# EAGLE design UltiMem64_v2 (EAGLE 7.7.0)

## Sheet 1 of 2
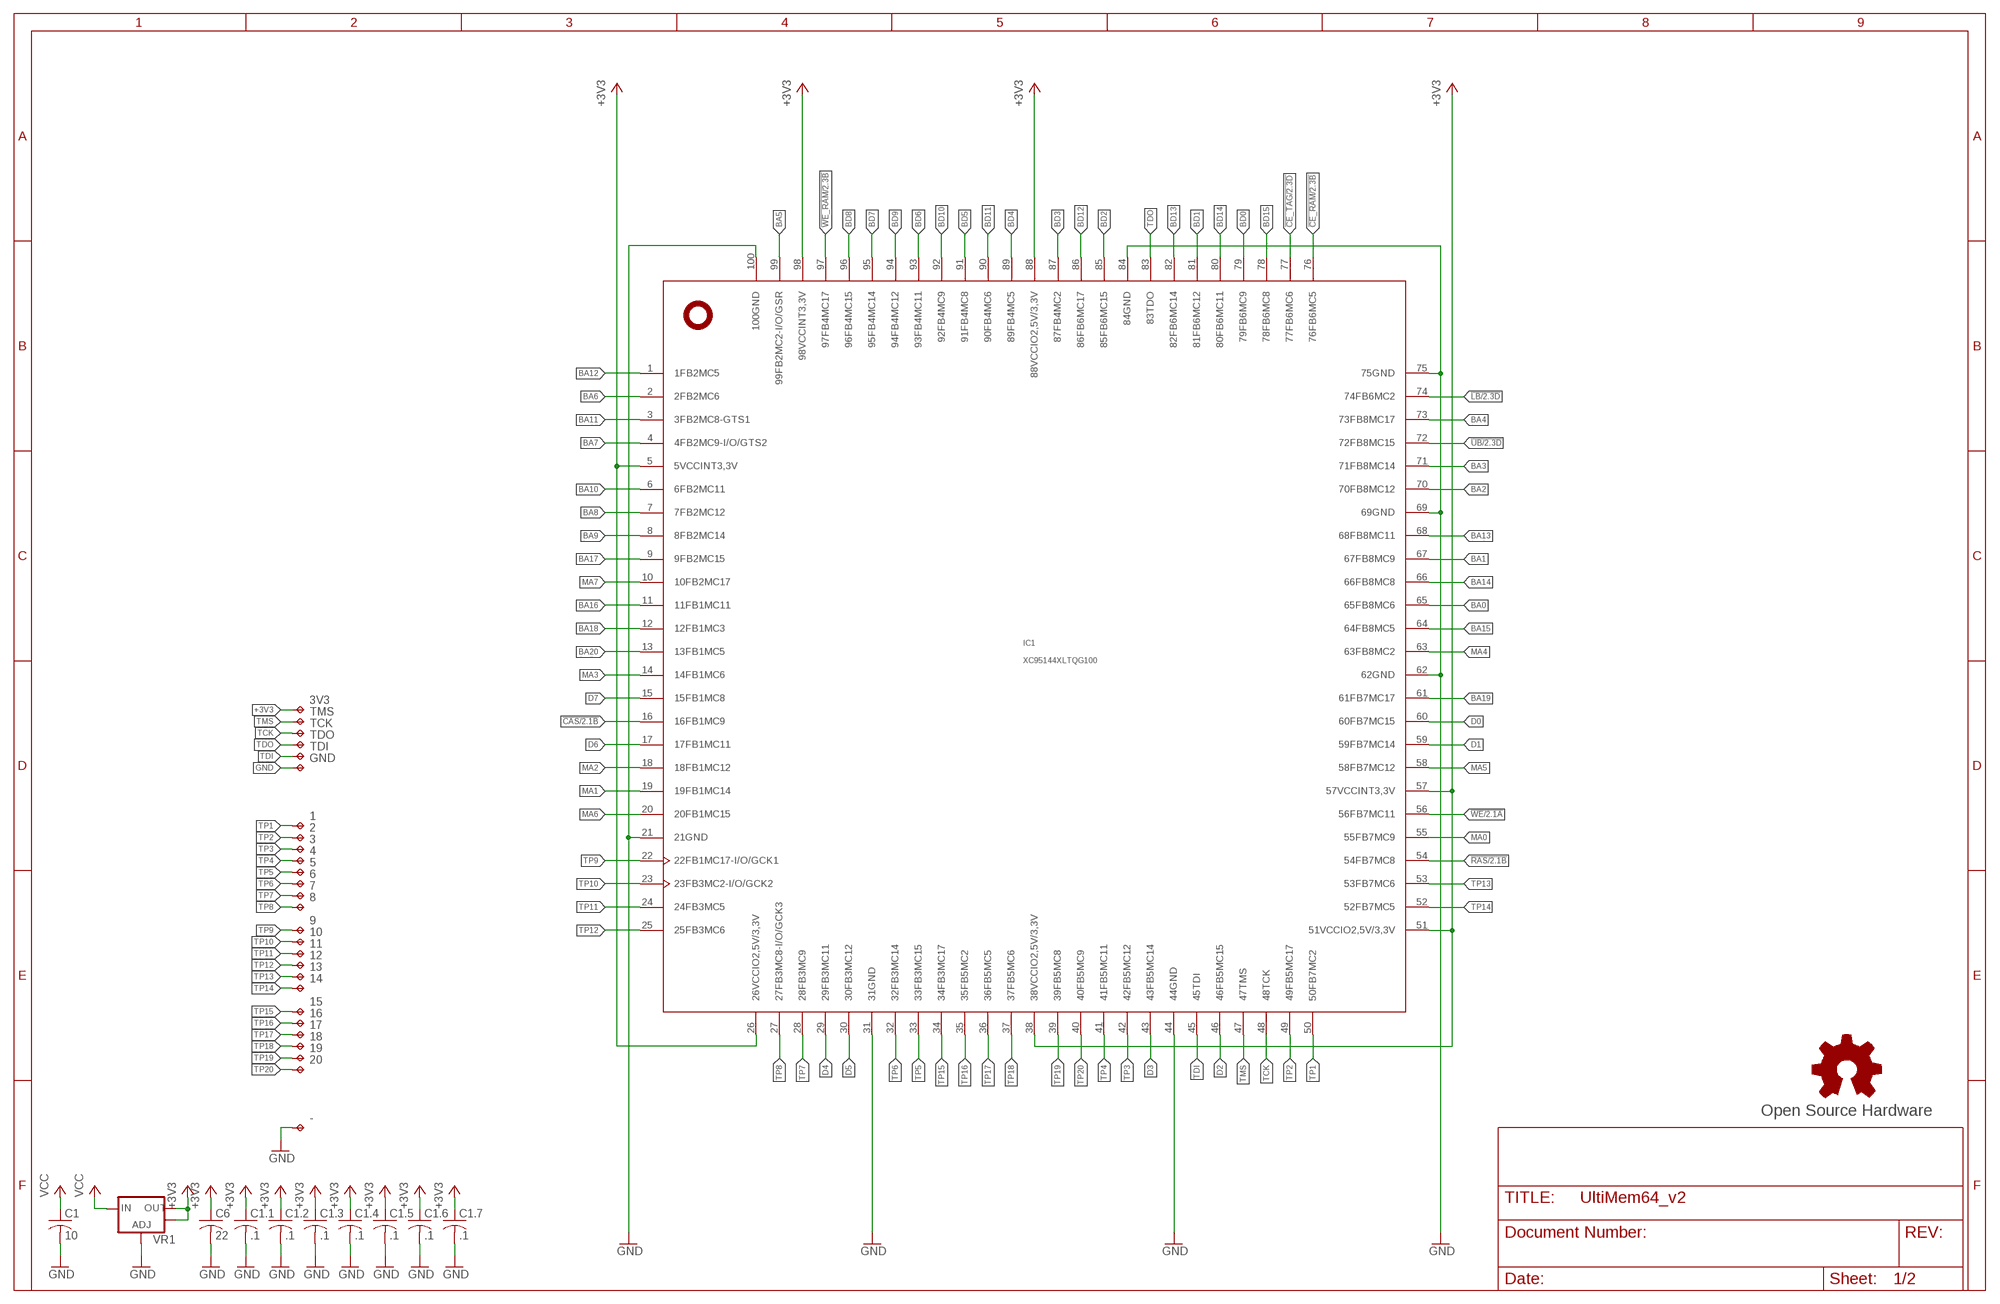
[diagram p0: schematic, sheet 1]

### Parts
1  TPPAD1-13  [P1-13]
2  TPPAD1-13  [P1-13]
3  TPPAD1-13  [P1-13]
3V3  TPTP09R  [TP09R]
4  TPPAD1-13  [P1-13]
5  TPPAD1-13  [P1-13]
6  TPPAD1-13  [P1-13]
7  TPPAD1-13  [P1-13]
8  TPPAD1-13  [P1-13]
9  TPPAD1-13  [P1-13]
10  TPPAD1-13  [P1-13]
11  TPPAD1-13  [P1-13]
12  TPPAD1-13  [P1-13]
13  TPPAD1-13  [P1-13]
14  TPPAD1-13  [P1-13]
15  TPTP08R  [TP08R]
16  TPTP08R  [TP08R]
17  TPTP08R  [TP08R]
18  TPTP08R  [TP08R]
19  TPTP08R  [TP08R]
20  TPTP08R  [TP08R]
-  TPPAD1-13  [P1-13]
C1  10  C-USC0805  [C0805]
C1.1  .1  C-USC0402  [C0402]
C1.2  .1  C-USC0402  [C0402]
C1.3  .1  C-USC0402  [C0402]
C1.4  .1  C-USC0402  [C0402]
C1.5  .1  C-USC0402  [C0402]
C1.6  .1  C-USC0402  [C0402]
C1.7  .1  C-USC0402  [C0402]
C6  22  C-USC0805  [C0805]
GND  TPTP10R  [TP10R]
GOLD_ORB_SM1  Open Source Hardware  OSHWLOGOLOGO5MM  [OSHW_5MM]
IC1  XC95144XLTQG100  [TQFP100]
TCK  TPTP09R  [TP09R]
TDI  TPTP09R  [TP09R]
TDO  TPTP09R  [TP09R]
TMS  TPTP09R  [TP09R]
VR1  V_REG_LM1117SOT223  [SOT223]

### Nets
!CAS: IC1.16(16FB1MC9) ; also sheet 2
!CE_RAM: IC1.76(76FB6MC5) ; also sheet 2
!CE_TAG: IC1.77(77FB6MC6) ; also sheet 2
!LB: IC1.74(74FB6MC2) ; also sheet 2
!RAS: IC1.54(54FB7MC8) ; also sheet 2
!UB: IC1.72(72FB8MC15) ; also sheet 2
!WE: IC1.56(56FB7MC11) ; also sheet 2
!WE_RAM: IC1.97(97FB4MC17) ; also sheet 2
+3V3: 3V3.TP C1.1.1 C1.2.1 C1.3.1 C1.4.1 C1.5.1 C1.6.1 C1.7.1 C6.1 IC1.5(5VCCINT3,3V) IC1.26(26VCCIO2,5V/3,3V) IC1.38(38VCCIO2,5V/3,3V) IC1.51(51VCCIO2,5V/3,3V) IC1.57(57VCCINT3,3V) IC1.88(88VCCIO2,5V/3,3V) IC1.98(98VCCINT3,3V) VR1.2(OUT) VR1.4(OUT) ; also sheet 2
BA0: IC1.65(65FB8MC6) ; also sheet 2
BA1: IC1.67(67FB8MC9) ; also sheet 2
BA2: IC1.70(70FB8MC12) ; also sheet 2
BA3: IC1.71(71FB8MC14) ; also sheet 2
BA4: IC1.73(73FB8MC17) ; also sheet 2
BA5: IC1.99(99FB2MC2-I/O/GSR) ; also sheet 2
BA6: IC1.2(2FB2MC6) ; also sheet 2
BA7: IC1.4(4FB2MC9-I/O/GTS2) ; also sheet 2
BA8: IC1.7(7FB2MC12) ; also sheet 2
BA9: IC1.8(8FB2MC14) ; also sheet 2
BA10: IC1.6(6FB2MC11) ; also sheet 2
BA11: IC1.3(3FB2MC8-GTS1) ; also sheet 2
BA12: IC1.1(1FB2MC5) ; also sheet 2
BA13: IC1.68(68FB8MC11) ; also sheet 2
BA14: IC1.66(66FB8MC8) ; also sheet 2
BA15: IC1.64(64FB8MC5) ; also sheet 2
BA16: IC1.11(11FB1MC11) ; also sheet 2
BA17: IC1.9(9FB2MC15) ; also sheet 2
BA18: IC1.12(12FB1MC3) ; also sheet 2
BA19: IC1.61(61FB7MC17) ; also sheet 2
BA20: IC1.13(13FB1MC5) ; also sheet 2
BD0: IC1.79(79FB6MC9) ; also sheet 2
BD1: IC1.81(81FB6MC12) ; also sheet 2
BD2: IC1.85(85FB6MC15) ; also sheet 2
BD3: IC1.87(87FB4MC2) ; also sheet 2
BD4: IC1.89(89FB4MC5) ; also sheet 2
BD5: IC1.91(91FB4MC8) ; also sheet 2
BD6: IC1.93(93FB4MC11) ; also sheet 2
BD7: IC1.95(95FB4MC14) ; also sheet 2
BD8: IC1.96(96FB4MC15) ; also sheet 2
BD9: IC1.94(94FB4MC12) ; also sheet 2
BD10: IC1.92(92FB4MC9) ; also sheet 2
BD11: IC1.90(90FB4MC6) ; also sheet 2
BD12: IC1.86(86FB6MC17) ; also sheet 2
BD13: IC1.82(82FB6MC14) ; also sheet 2
BD14: IC1.80(80FB6MC11) ; also sheet 2
BD15: IC1.78(78FB6MC8) ; also sheet 2
D0: IC1.60(60FB7MC15) ; also sheet 2
D1: IC1.59(59FB7MC14) ; also sheet 2
D2: IC1.46(46FB5MC15) ; also sheet 2
D3: IC1.43(43FB5MC14) ; also sheet 2
D4: IC1.29(29FB3MC11) ; also sheet 2
D5: IC1.30(30FB3MC12) ; also sheet 2
D6: IC1.17(17FB1MC11) ; also sheet 2
D7: IC1.15(15FB1MC8) ; also sheet 2
GND: -.TP C1.1.2 C1.2 C1.2.2 C1.3.2 C1.4.2 C1.5.2 C1.6.2 C1.7.2 C6.2 GND.TP IC1.21(21GND) IC1.31(31GND) IC1.44(44GND) IC1.62(62GND) IC1.69(69GND) IC1.75(75GND) IC1.84(84GND) IC1.100(100GND) VR1.1(ADJ) ; also sheet 2
MA0: IC1.55(55FB7MC9) ; also sheet 2
MA1: IC1.19(19FB1MC14) ; also sheet 2
MA2: IC1.18(18FB1MC12) ; also sheet 2
MA3: IC1.14(14FB1MC6) ; also sheet 2
MA4: IC1.63(63FB8MC2) ; also sheet 2
MA5: IC1.58(58FB7MC12) ; also sheet 2
MA6: IC1.20(20FB1MC15) ; also sheet 2
MA7: IC1.10(10FB2MC17) ; also sheet 2
TCK: IC1.48(48TCK) TCK.TP
TDI: IC1.45(45TDI) TDI.TP
TDO: IC1.83(83TDO) TDO.TP
TMS: IC1.47(47TMS) TMS.TP
TP1: 1.TP IC1.50(50FB7MC2)
TP2: 2.TP IC1.49(49FB5MC17)
TP3: 3.TP IC1.42(42FB5MC12)
TP4: 4.TP IC1.41(41FB5MC11)
TP5: 5.TP IC1.33(33FB3MC15)
TP6: 6.TP IC1.32(32FB3MC14)
TP7: 7.TP IC1.28(28FB3MC9)
TP8: 8.TP IC1.27(27FB3MC8-I/O/GCK3)
TP9: 9.TP IC1.22(22FB1MC17-I/O/GCK1)
TP10: 10.TP IC1.23(23FB3MC2-I/O/GCK2)
TP11: 11.TP IC1.24(24FB3MC5)
TP12: 12.TP IC1.25(25FB3MC6)
TP13: 13.TP IC1.53(53FB7MC6)
TP14: 14.TP IC1.52(52FB7MC5)
TP15: 15.TP IC1.34(34FB3MC17)
TP16: 16.TP IC1.35(35FB5MC2)
TP17: 17.TP IC1.36(36FB5MC5)
TP18: 18.TP IC1.37(37FB5MC6)
TP19: 19.TP IC1.39(39FB5MC8)
TP20: 20.TP IC1.40(40FB5MC9)
VCC: C1.1 VR1.3(IN) ; also sheet 2

## Sheet 2 of 2: MEMORY
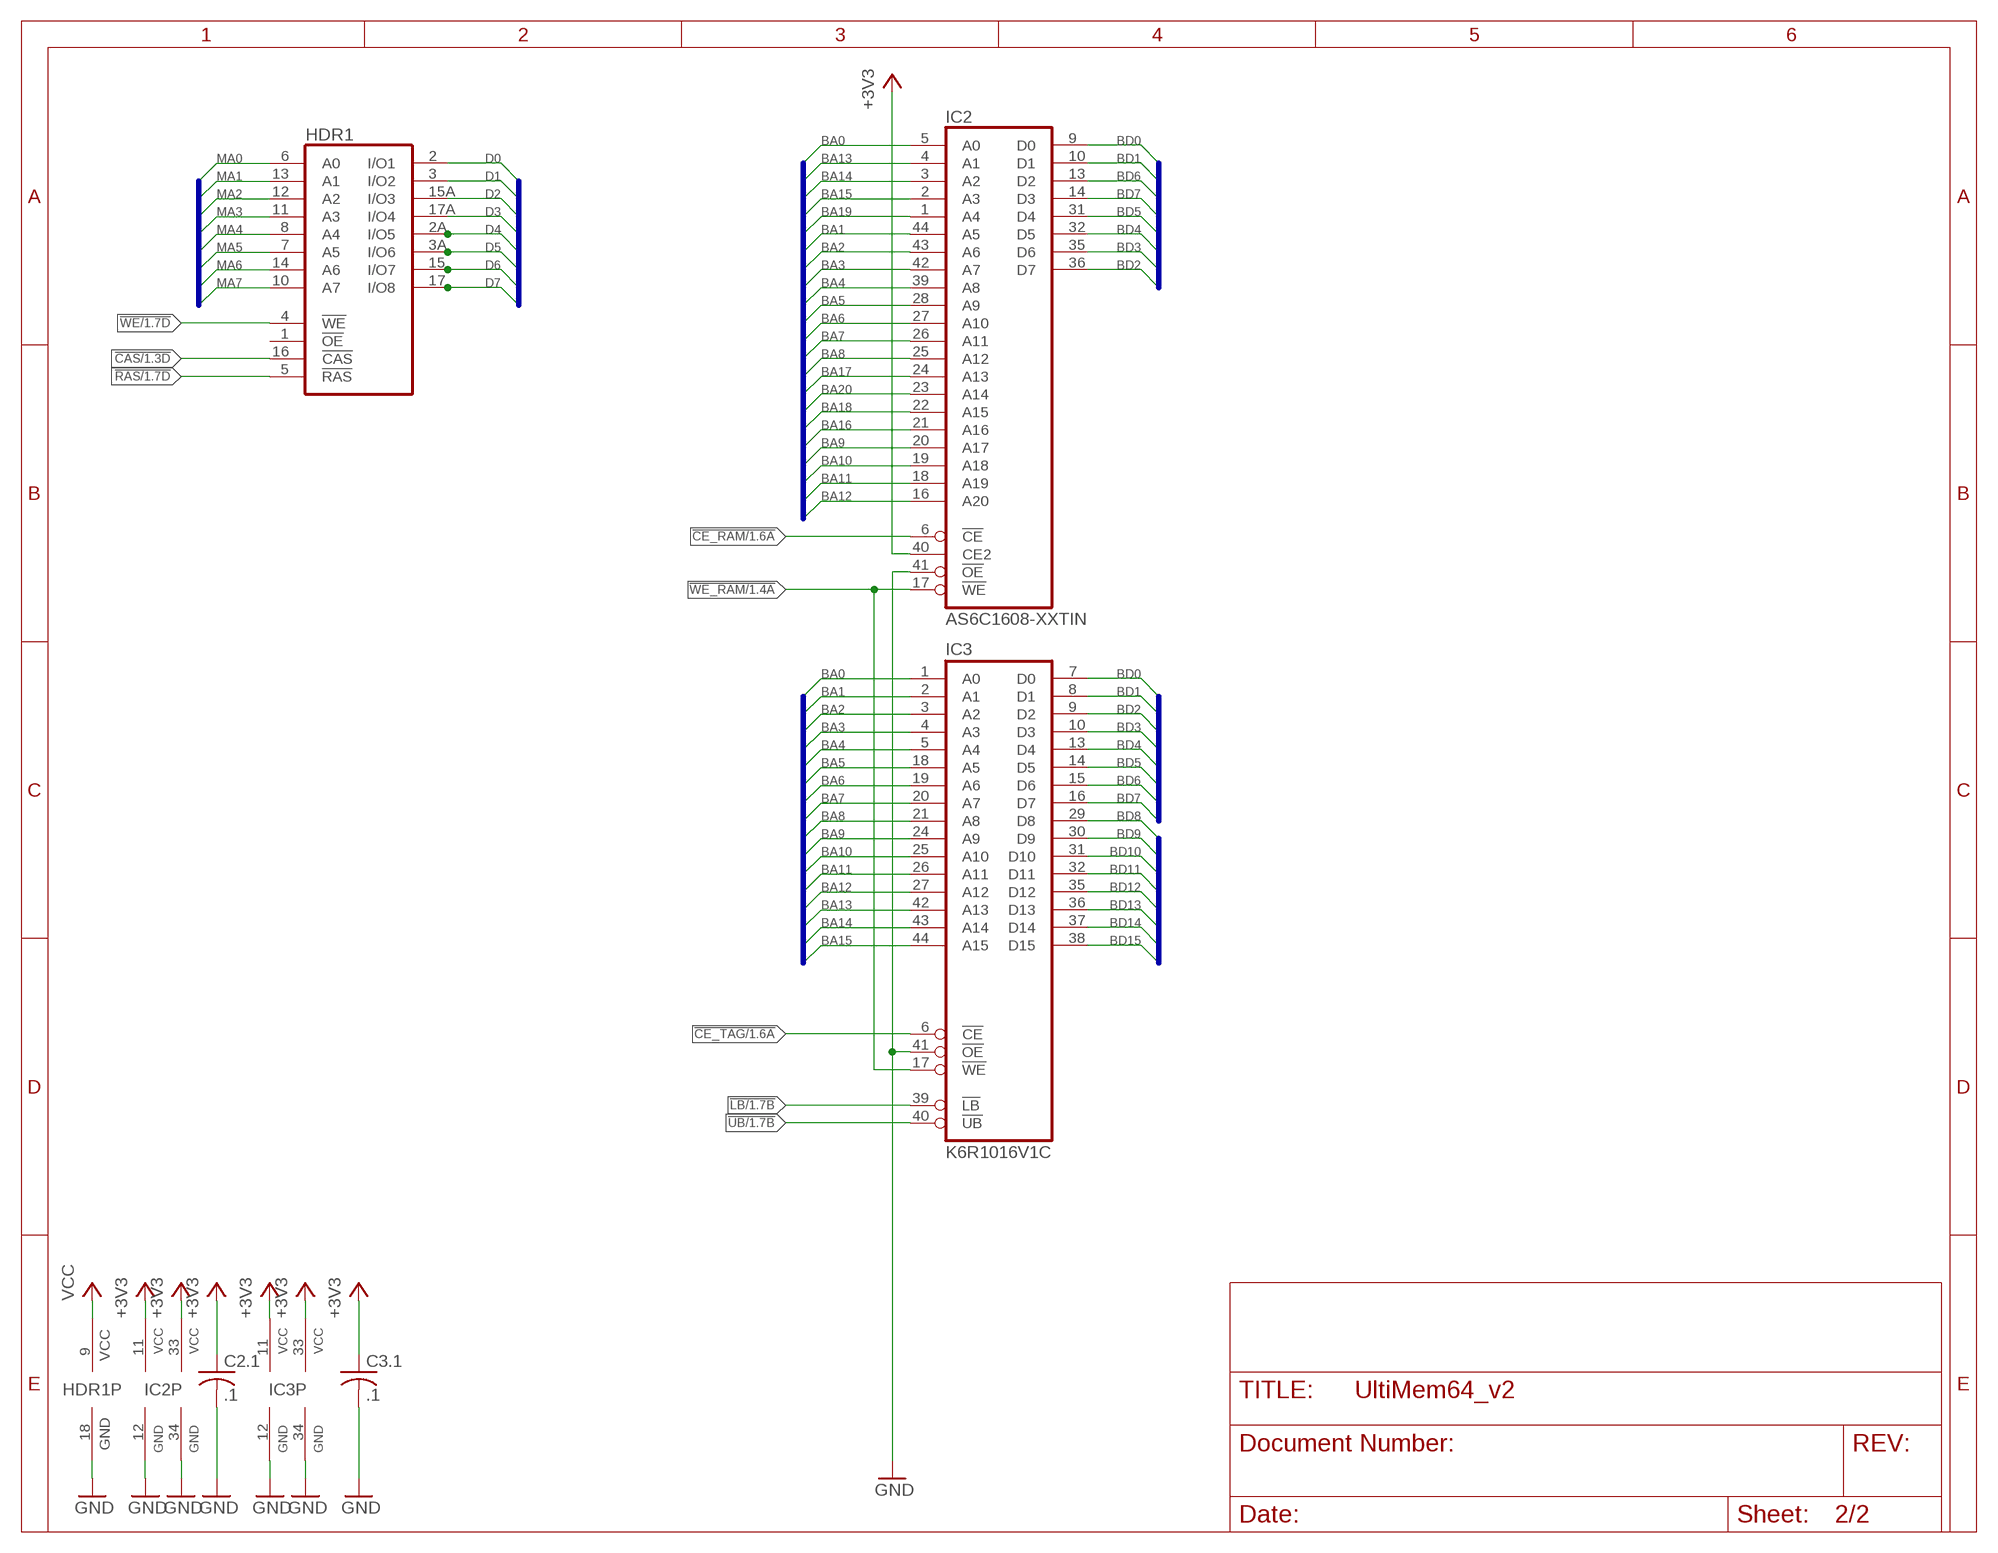
[diagram p1: schematic, sheet 2]

### Parts
C2.1  .1  C-USC0402  [C0402]
C3.1  .1  C-USC0402  [C0402]
HDR1  2X41464C-HDR  [2XDIL18_REV]
IC2  AS6C1608-XXTIN  [TSOP44-II]
IC3  K6R1016V1C  [SOJ44/4]

### Nets
!CAS: HDR1.16(!CAS) ; also sheet 1
!CE_RAM: IC2.6(!CE) ; also sheet 1
!CE_TAG: IC3.6(!CE) ; also sheet 1
!LB: IC3.39(!LB) ; also sheet 1
!RAS: HDR1.5(!RAS) ; also sheet 1
!UB: IC3.40(!UB) ; also sheet 1
!WE: HDR1.4(!WE) ; also sheet 1
!WE_RAM: IC2.17(!WE) IC3.17(!WE) ; also sheet 1
+3V3: C2.1.1 C3.1.1 IC2.11(VCC) IC2.33(VCC) IC2.40(CE2) IC3.11(VCC) IC3.33(VCC) ; also sheet 1
BA0: IC2.5(A0) IC3.1(A0) ; also sheet 1
BA1: IC2.44(A5) IC3.2(A1) ; also sheet 1
BA2: IC2.43(A6) IC3.3(A2) ; also sheet 1
BA3: IC2.42(A7) IC3.4(A3) ; also sheet 1
BA4: IC2.39(A8) IC3.5(A4) ; also sheet 1
BA5: IC2.28(A9) IC3.18(A5) ; also sheet 1
BA6: IC2.27(A10) IC3.19(A6) ; also sheet 1
BA7: IC2.26(A11) IC3.20(A7) ; also sheet 1
BA8: IC2.25(A12) IC3.21(A8) ; also sheet 1
BA9: IC2.20(A17) IC3.24(A9) ; also sheet 1
BA10: IC2.19(A18) IC3.25(A10) ; also sheet 1
BA11: IC2.18(A19) IC3.26(A11) ; also sheet 1
BA12: IC2.16(A20) IC3.27(A12) ; also sheet 1
BA13: IC2.4(A1) IC3.42(A13) ; also sheet 1
BA14: IC2.3(A2) IC3.43(A14) ; also sheet 1
BA15: IC2.2(A3) IC3.44(A15) ; also sheet 1
BA16: IC2.21(A16) ; also sheet 1
BA17: IC2.24(A13) ; also sheet 1
BA18: IC2.22(A15) ; also sheet 1
BA19: IC2.1(A4) ; also sheet 1
BA20: IC2.23(A14) ; also sheet 1
BD0: IC2.9(D0) IC3.7(D0) ; also sheet 1
BD1: IC2.10(D1) IC3.8(D1) ; also sheet 1
BD2: IC2.36(D7) IC3.9(D2) ; also sheet 1
BD3: IC2.35(D6) IC3.10(D3) ; also sheet 1
BD4: IC2.32(D5) IC3.13(D4) ; also sheet 1
BD5: IC2.31(D4) IC3.14(D5) ; also sheet 1
BD6: IC2.13(D2) IC3.15(D6) ; also sheet 1
BD7: IC2.14(D3) IC3.16(D7) ; also sheet 1
BD8: IC3.29(D8) ; also sheet 1
BD9: IC3.30(D9) ; also sheet 1
BD10: IC3.31(D10) ; also sheet 1
BD11: IC3.32(D11) ; also sheet 1
BD12: IC3.35(D12) ; also sheet 1
BD13: IC3.36(D13) ; also sheet 1
BD14: IC3.37(D14) ; also sheet 1
BD15: IC3.38(D15) ; also sheet 1
D0: HDR1.2(I/O1) ; also sheet 1
D1: HDR1.3(I/O2) ; also sheet 1
D2: HDR1.15A(I/O3) ; also sheet 1
D3: HDR1.17A(I/O4) ; also sheet 1
D4: HDR1.2A(I/O5) ; also sheet 1
D5: HDR1.3A(I/O6) ; also sheet 1
D6: HDR1.15(I/O7) ; also sheet 1
D7: HDR1.17(I/O8) ; also sheet 1
GND: C2.1.2 C3.1.2 HDR1.18(GND) IC2.12(GND) IC2.34(GND) IC2.41(!OE) IC3.12(GND) IC3.34(GND) IC3.41(!OE) ; also sheet 1
MA0: HDR1.6(A0) ; also sheet 1
MA1: HDR1.13(A1) ; also sheet 1
MA2: HDR1.12(A2) ; also sheet 1
MA3: HDR1.11(A3) ; also sheet 1
MA4: HDR1.8(A4) ; also sheet 1
MA5: HDR1.7(A5) ; also sheet 1
MA6: HDR1.14(A6) ; also sheet 1
MA7: HDR1.10(A7) ; also sheet 1
VCC: HDR1.9(VCC) ; also sheet 1
Unconnected: HDR1.1(!OE)

### Buses
MA[0..7]
D[0..7]
BD[0..15]
BA[0..20]

## Library data of the parts
1-3 3V3 4-20 - GND TCK TDI TDO TMS = testpad:TP: Test pad
C1 C1.1-C1.7 C2.1 C3.1 C6 = rcl:C-US: CAPACITOR, American symbol
GOLD_ORB_SM1 = oshw:OSHWLOGO: The OSHW logo for PCB layout
HDR1 = commodore:2X41464C: MEMORY
IC1 = xilinx_xc95XXXxl:XC95144XLTQG100
IC2 = memory-alliance:AS6C1608-XX
IC3 = memory-samsung-jlb:K6R1016V1C
VR1 = SparkFun:V_REG_LM1117: Voltage Regulator LM1117 Standard adjustable voltage regulator but in SMD form. Spark Fun Electronics SKU : COM-00595

## Board
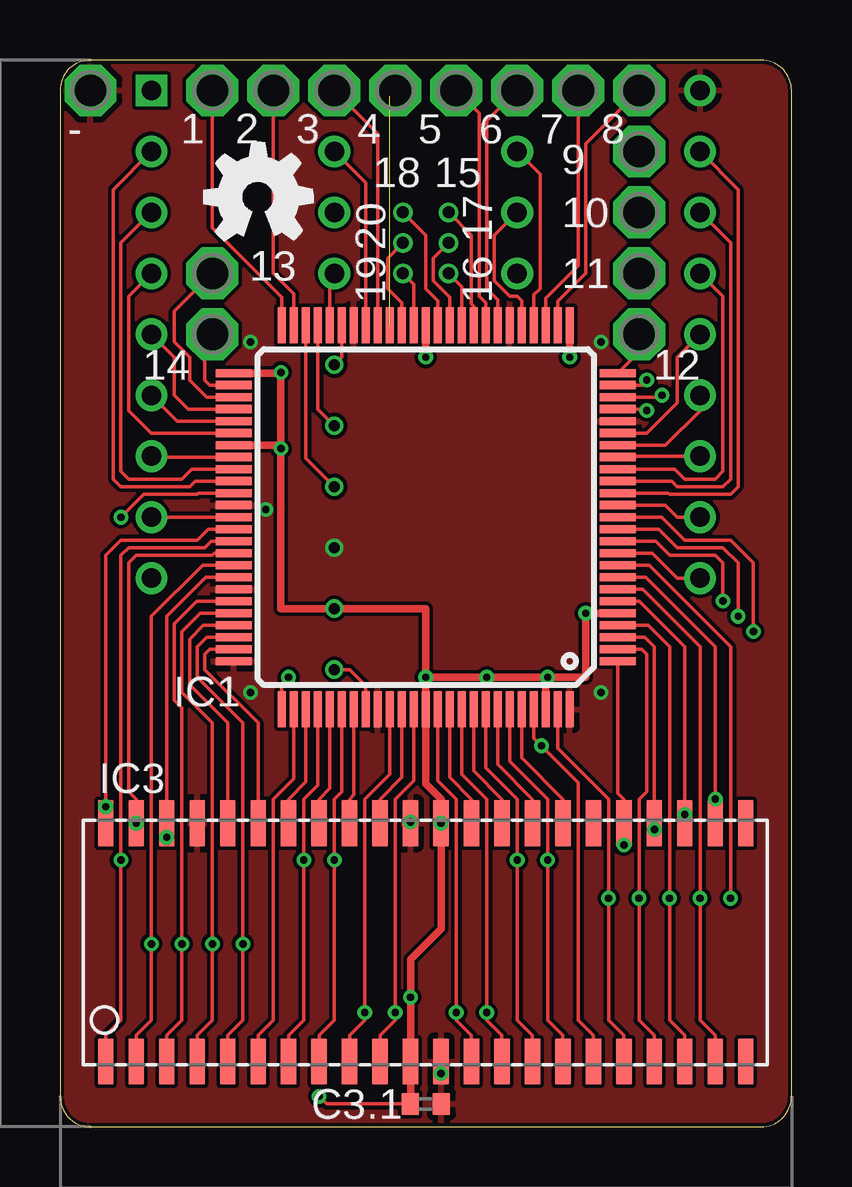
[diagram p2: board, top side]
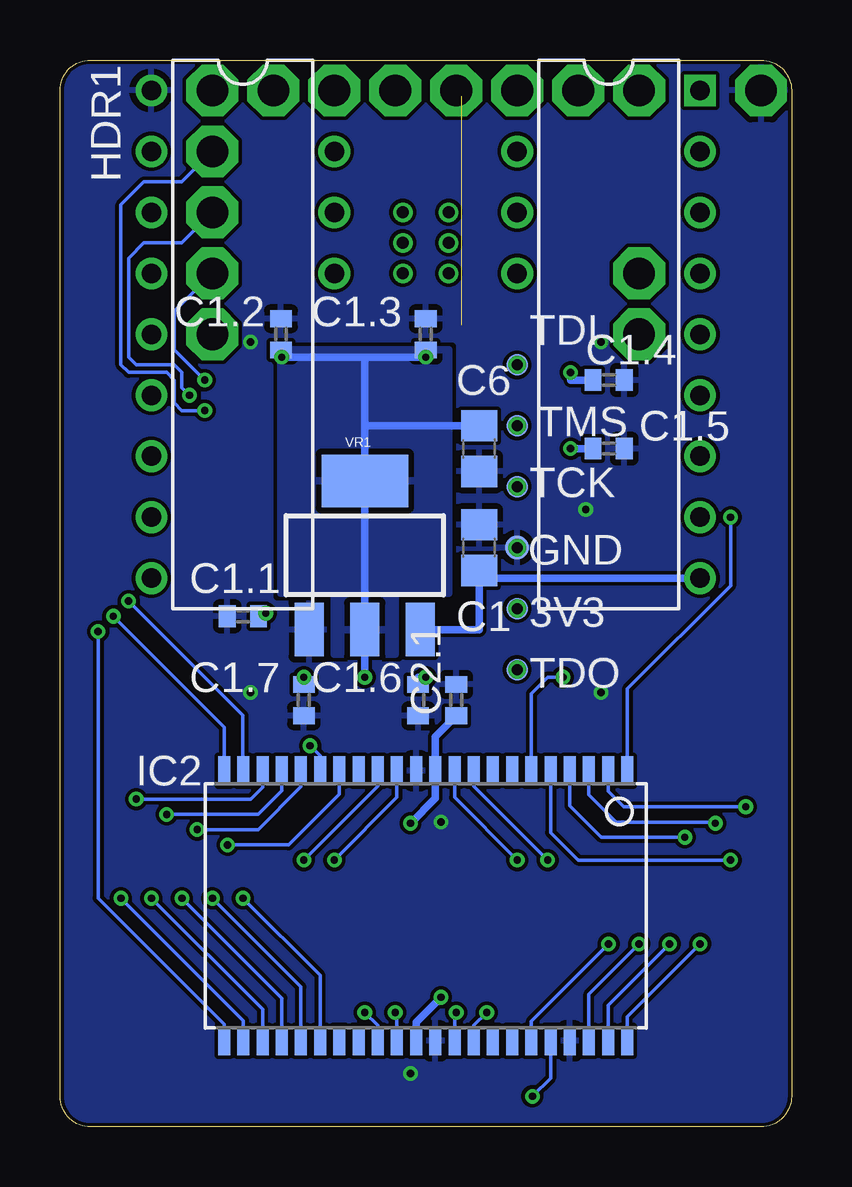
[diagram p3: board, bottom side, seen from below]

Size 30.48 x 44.45 mm. Coordinates in mm from the lower left corner, seen from the top.
Outline: 29.21,44.45 1.27,44.45 arc90 0,43.18 0,1.27 arc90 1.27,0 29.21,0 arc90 30.48,1.27 30.48,43.18 arc90 29.21,44.45
Copper layers (1*16): Top 0.035mm / dielectric 1.5mm / Bottom 0.035mm
Design rules "hackvana *": minimum track width 6mil, minimum drill 0.3mm, track to track 6mil, track to pad 6mil, pad to pad 6mil, via to via 6mil, smd to smd 0mil, copper to edge 6mil, drill to drill 6mil, minimum pad ring 10mil, minimum via ring 6mil, stop-mask expansion 2mil, vias tented up to drill 100mil, thermal gap 10mil

### Footprints (pad centres in the part's own frame; a part is rotated, then mirrored left to right if it is on the bottom)
P1-13 = drill 1.321 pad 2.159 octagon: TP 0,0
TP09R = smd 0.9 x 0.9: TP 0,0
TP08R = smd 0.8 x 0.8: TP 0,0
C0805 = smd 1.3 x 1.5: 1 -0.95,0; 2 0.95,0
C0402 = smd 0.7 x 0.9: 1 -0.65,0; 2 0.65,0
TP10R = smd 1 x 1: TP 0,0
2XDIL18_REV = drill 0.813 square: 1 -10.16,-11.43 | drill 0.813: 2 -7.62,-11.43; 2A -7.62,3.81; 3 -5.08,-11.43; 3A -5.08,3.81; 4 -2.54,-11.43; 4A -2.54,3.81; 5 0,-11.43; 6 2.54,-11.43; 7 5.08,-11.43; 8 7.62,-11.43; 9 10.16,-11.43; 10 10.16,11.43; 11 7.62,11.43; 12 5.08,11.43; 13 2.54,11.43; 14 0,11.43; 15 -2.54,11.43; 15A -2.54,-3.81; 16 -5.08,11.43; 16A -5.08,-3.81; 17 -7.62,11.43; 17A -7.62,-3.81; 18 -10.16,11.43
TQFP100 = smd 1.5 x 0.35: 1 -8,6; 2 -8,5.5; 3 -8,5; 4 -8,4.5; 5 -8,4; 6 -8,3.5; 7 -8,3; 8 -8,2.5; 9 -8,2; 10 -8,1.5; 11 -8,1; 12 -8,0.5; 13 -8,0; 14 -8,-0.5; 15 -8,-1; 16 -8,-1.5; 17 -8,-2; 18 -8,-2.5; 19 -8,-3; 20 -8,-3.5; 21 -8,-4; 22 -8,-4.5; 23 -8,-5; 24 -8,-5.5; 25 -8,-6; 51 8,-6; 52 8,-5.5; 53 8,-5; 54 8,-4.5; 55 8,-4; 56 8,-3.5; 57 8,-3; 58 8,-2.5; 59 8,-2; 60 8,-1.5; 61 8,-1; 62 8,-0.5; 63 8,0; 64 8,0.5; 65 8,1; 66 8,1.5; 67 8,2; 68 8,2.5; 69 8,3; 70 8,3.5; 71 8,4; 72 8,4.5; 73 8,5; 74 8,5.5; 75 8,6 | smd 0.35 x 1.5: 26 -6,-8; 27 -5.5,-8; 28 -5,-8; 29 -4.5,-8; 30 -4,-8; 31 -3.5,-8; 32 -3,-8; 33 -2.5,-8; 34 -2,-8; 35 -1.5,-8; 36 -1,-8; 37 -0.5,-8; 38 0,-8; 39 0.5,-8; 40 1,-8; 41 1.5,-8; 42 2,-8; 43 2.5,-8; 44 3,-8; 45 3.5,-8; 46 4,-8; 47 4.5,-8; 48 5,-8; 49 5.5,-8; 50 6,-8; 76 6,8; 77 5.5,8; 78 5,8; 79 4.5,8; 80 4,8; 81 3.5,8; 82 3,8; 83 2.5,8; 84 2,8; 85 1.5,8; 86 1,8; 87 0.5,8; 88 0,8; 89 -0.5,8; 90 -1,8; 91 -1.5,8; 92 -2,8; 93 -2.5,8; 94 -3,8; 95 -3.5,8; 96 -4,8; 97 -4.5,8; 98 -5,8; 99 -5.5,8; 100 -6,8
TSOP44-II = smd 0.5 x 1.2: 1 -8.4,-5.627; 2 -7.6,-5.627; 3 -6.8,-5.627; 4 -6,-5.627; 5 -5.2,-5.627; 6 -4.4,-5.627; 7 -3.6,-5.627; 8 -2.8,-5.627; 9 -2,-5.627; 10 -1.2,-5.627; 11 -0.4,-5.627; 12 0.4,-5.627; 13 1.2,-5.627; 14 2,-5.627; 15 2.8,-5.627; 16 3.6,-5.627; 17 4.4,-5.627; 18 5.2,-5.627; 19 6,-5.627; 20 6.8,-5.627; 21 7.6,-5.627; 22 8.4,-5.627; 23 8.4,5.627; 24 7.6,5.627; 25 6.8,5.627; 26 6,5.627; 27 5.2,5.627; 28 4.4,5.627; 29 3.6,5.627; 30 2.8,5.627; 31 2,5.627; 32 1.2,5.627; 33 0.4,5.627; 34 -0.4,5.627; 35 -1.2,5.627; 36 -2,5.627; 37 -2.8,5.627; 38 -3.6,5.627; 39 -4.4,5.627; 40 -5.2,5.627; 41 -6,5.627; 42 -6.8,5.627; 43 -7.6,5.627; 44 -8.4,5.627
SOJ44/4 = smd 0.635 x 1.905: 1 -12.7,-4.902; 2 -11.43,-4.902; 3 -10.16,-4.902; 4 -8.89,-4.902; 5 -7.62,-4.902; 6 -6.35,-4.902; 7 -5.08,-4.902; 8 -3.81,-4.902; 9 -2.54,-4.902; 10 -1.27,-4.902; 11 0,-4.902; 12 1.27,-4.902; 13 2.54,-4.902; 14 3.81,-4.902; 15 5.08,-4.902; 16 6.35,-4.902; 17 7.62,-4.902; 18 8.89,-4.902; 19 10.16,-4.902; 20 11.43,-4.902; 21 12.7,-4.902; 22 13.97,-4.902; 23 13.97,5.029; 24 12.7,5.029; 25 11.43,5.029; 26 10.16,5.029; 27 8.89,5.029; 28 7.62,5.029; 29 6.35,5.029; 30 5.08,5.029; 31 3.81,5.029; 32 2.54,5.029; 33 1.27,5.029; 34 0,5.029; 35 -1.27,5.029; 36 -2.54,5.029; 37 -3.81,5.029; 38 -5.08,5.029; 39 -6.35,5.029; 40 -7.62,5.029; 41 -8.89,5.029; 42 -10.16,5.029; 43 -11.43,5.029; 44 -12.7,5.029
SOT223 = smd 1.219 x 2.235: 1 -2.311,-3.099; 2 0,-3.099; 3 2.311,-3.099 | smd 3.6 x 2.2: 4 0,3.099

### Placement (x,y rotation side)
1  6.35,43.18 0 top
2  8.89,43.18 0 top
3  11.43,43.18 0 top
3V3  11.43,21.59 0 bottom
4  13.97,43.18 0 top
5  16.51,43.18 0 top
6  19.05,43.18 0 top
7  21.59,43.18 0 top
8  24.13,43.18 0 top
9  24.13,40.64 0 top
10  24.13,38.1 0 top
11  24.13,35.56 0 top
12  24.13,33.02 0 top
13  6.35,35.56 0 top
14  6.35,33.02 0 top
15  16.19,38.1 270 top
16  16.19,35.56 270 top
17  16.19,36.83 270 top
18  14.29,38.1 270 top
19  14.29,35.56 270 top
20  14.29,36.83 270 top
-  1.27,43.18 0 top
C1  13.02,24.13 90 bottom
C1.1  22.86,21.27 180 bottom
C1.2  21.27,33.02 90 bottom
C1.3  15.24,33.02 90 bottom
C1.4  7.62,31.11 0 bottom
C1.5  7.62,28.26 0 bottom
C1.6  15.56,17.78 270 bottom
C1.7  20.32,17.78 270 bottom
C2.1  13.97,17.78 90 bottom
C3.1  15.24,0.95 0 top
C6  13.02,28.26 270 bottom
GND  11.43,24.13 0 bottom
GOLD_ORB_SM1  8.25,38.74 0 top
HDR1  15.24,33.02 270 top
IC1  15.24,25.4 180 top
IC2  15.24,9.21 180 bottom
IC3  14.61,7.62 0 top
TCK  11.43,26.67 0 bottom
TDI  11.43,31.75 0 bottom
TDO  11.43,19.05 0 bottom
TMS  11.43,29.21 0 bottom
VR1  17.78,23.81 0 bottom

### Tracks (layer width: path | path; a pad name or v marks a point on that pad's centre or on a via)
!CAS
  Top 0.152: IC1.16 25.49,26.9 25.72,26.67 27.62,26.67 27.94,26.99 27.94,36.83 HDR1.16
!CE_RAM  (via drill 0.3)
  Top 0.152: IC1.76 9.24,18.45 v9.53,18.73
  Bottom 0.152: v9.53,18.73 10.16,18.73 10.84,18.05 IC2.6
!CE_TAG
  Top 0.152: IC1.77 9.74,14.5 8.89,13.65 8.89,4.45 8.25,3.81 IC3.6
!LB
  Top 0.152: IC1.74 6.25,19.9 6.03,19.68 6.03,19.05 8.25,16.83 IC3.39
!RAS
  Top 0.152: IC1.54 5.34,29.9 4.76,30.48 4.76,32.07 HDR1.5
!UB
  Top 0.152: IC1.72 5.98,20.9 5.4,20.32 5.4,18.41 6.98,16.83 IC3.40
!WE
  Top 0.152: HDR1.4 2.86,34.61 2.86,29.84 3.8,28.9 IC1.56
!WE_RAM  (via drill 0.3)
  Top 0.152: IC3.17 22.23,3.81 21.59,4.45 21.59,14.34 v20.06,15.88 19.74,16.19 IC1.97
  Bottom 0.152: IC2.17 19.64,15.46 v20.06,15.88
+3V3  (via drill 0.3, 0.46)
  Top 0.152: v10.79,1.27 11.11,0.95 C3.1.1
  Top 0.305: v15.24,18.73 IC1.88 15.24,14.29 15.88,13.65 IC3.33 15.88,8.26 14.61,6.98 v14.61,5.4 IC3.11 14.61,0.97 C3.1.1 | 20.24,18.73 IC1.98 | 20.24,18.73 v17.78,18.73 v15.24,18.73 | IC1.5 v21.91,21.4 21.91,18.73 v20.32,18.73 20.24,18.73 | IC1.38 v15.24,32.07 | v21.24,32.07 IC1.26 | IC1.57 9.21,28.4 | 9.21,31.4 IC1.51 | v15.24,18.73 15.24,21.59 3V3.TP 9.21,21.59 v9.21,28.26 9.21,28.4 | v9.21,31.43 9.21,31.4 | 9.21,31.4 9.21,28.4
  Bottom 0.152: IC2.40 10.04,2.02 v10.79,1.27
  Bottom 0.305: v17.78,18.73 VR1.2 VR1.4 | 17.78,32.07 v21.24,32.07 21.27,32.07 C1.2.1 | VR1.4 17.78,32.07 | C6.1 17.78,29.21 VR1.4 | C1.1.1 22.21,21.4 v21.91,21.4 | C1.7.1 v20.32,18.73 | C1.6.1 15.56,18.73 v15.24,18.73 | C1.5.1 v9.21,28.26 | C1.4.1 9.21,31.11 v9.21,31.43 | C1.3.1 v15.24,32.07 17.78,32.07 | IC3.33 14.84,13.68 IC2.11 14.84,16.26 C2.1.1 | IC2.33 15.64,4.36 v14.61,5.4
  other vias: 11.43,21.59 15.88,12.65
  pour Bottom: 16.51,22.22 16.51,19.68 19.05,19.68 19.05,22.22 21.27,22.22 21.27,32.38 14.29,32.38 14.29,22.22
BA0  (via drill 0.3)
  Top 0.152: IC1.65 6.3,24.4 6.03,24.13 2.86,24.13 2.54,23.81 v2.54,11.11 2.54,4.45 1.9,3.81 IC3.1
  Bottom 0.152: IC2.5 10.04,12.26 8.89,11.11 v2.54,11.11
BA1  (via drill 0.3)
  Top 0.152: IC1.67 5.94,23.4 3.81,21.27 v3.81,7.62 3.81,4.45 3.18,3.81 IC3.2
  Bottom 0.152: IC2.44 6.84,4.59 v3.81,7.62
BA2  (via drill 0.3)
  Top 0.152: IC1.70 5.71,21.9 4.76,20.95 4.76,17.78 5.08,17.46 v5.08,7.62 | v5.08,7.62 5.08,4.45 4.45,3.81 IC3.3 | v5.08,7.62 5.08,5.4
  Bottom 0.152: IC2.43 7.64,5.06 v5.08,7.62
BA3  (via drill 0.3)
  Top 0.152: IC1.71 5.84,21.4 5.08,20.64 5.08,18.1 6.35,16.83 v6.35,7.62 | v6.35,7.62 6.35,4.45 5.71,3.81 IC3.4 | v6.35,7.62 6.35,6.03
  Bottom 0.152: IC2.42 8.44,5.53 v6.35,7.62
BA4  (via drill 0.3)
  Top 0.152: IC1.73 6.11,20.4 5.71,20 5.71,18.73 7.62,16.83 v7.62,7.62 7.62,4.45 6.98,3.81 IC3.5
  Bottom 0.152: IC2.39 10.84,4.4 v7.62,7.62
BA5  (via drill 0.3)
  Top 0.152: IC1.99 20.74,15.77 22.86,13.65 v22.86,9.53 22.86,4.45 23.5,3.81 IC3.18
  Bottom 0.152: IC2.28 19.64,6.3 v22.86,9.53
BA6  (via drill 0.3)
  Top 0.152: IC1.2 24.23,19.9 24.45,19.68 24.45,13.97 24.13,13.65 v24.13,9.53 24.13,4.45 24.77,3.81 IC3.19
  Bottom 0.152: IC2.27 20.44,5.84 v24.13,9.53
BA7  (via drill 0.3)
  Top 0.152: IC1.4 24.5,20.9 25.4,20 v25.4,9.53 25.4,4.45 26.04,3.81 IC3.20
  Bottom 0.152: IC2.26 21.24,5.37 v25.4,9.53
BA8  (via drill 0.3)
  Top 0.152: IC1.7 24.27,22.4 26.67,20 v26.67,9.53 26.67,4.45 27.3,3.81 IC3.21
  Bottom 0.152: IC2.25 22.04,4.89 v26.67,9.53
BA9  (via drill 0.3)
  Top 0.152: IC1.8 24.41,22.9 27.3,20 v27.3,13.65 IC3.24
  Bottom 0.152: IC2.20 22.04,14.15 22.54,13.65 v27.3,13.65
BA10  (via drill 0.3)
  Top 0.152: IC1.6 24.14,21.9 26.04,20 v26.04,13.02 IC3.25
  Bottom 0.152: IC2.19 21.24,14 22.23,13.02 v26.04,13.02
BA11  (via drill 0.3)
  Top 0.152: IC1.3 24.37,20.4 24.77,20 IC3.26 v24.77,12.38
  Bottom 0.152: IC2.18 20.44,14.17 22.23,12.38 v24.77,12.38
BA12  (via drill 0.3)
  Top 0.152: IC1.1 23.24,13.91 23.5,13.65 IC3.27 v23.5,11.75
  Bottom 0.152: IC2.16 18.84,13.86 20.95,11.75 v23.5,11.75
BA13  (via drill 0.3)
  Top 0.152: IC1.68 6.07,22.9 4.45,21.27 IC3.42 v4.45,12.06
  Bottom 0.152: IC2.4 9.24,13.37 7.94,12.06 v4.45,12.06
BA14  (via drill 0.3)
  Top 0.152: IC1.66 6.44,23.9 6.35,23.81 3.18,23.81 2.86,23.5 2.86,13.97 3.18,13.65 IC3.43
  Bottom 0.152: IC2.3 8.44,13.84 7.3,12.7 3.23,12.7 IC3.43
  other vias: 3.18,12.65
BA15  (via drill 0.3)
  Top 0.152: IC1.64 6.17,24.9 5.71,24.45 2.54,24.45 1.9,23.81 v1.9,13.33 IC3.44
  Bottom 0.152: IC2.2 7.64,13.99 6.98,13.33 v1.9,13.33
BA16  (via drill 0.3)
  Top 0.152: IC1.11 24.81,24.4 25.4,23.81 27.3,23.81 27.62,23.5 v27.62,21.91
  Bottom 0.152: v27.62,21.91 22.86,17.14 22.86,14.86 IC2.21
BA17  (via drill 0.3)
  Top 0.152: IC1.9 24.54,23.4 27.94,20 v27.94,9.53
  Bottom 0.152: IC2.24 22.84,4.42 v27.94,9.53
BA18  (via drill 0.3)
  Top 0.152: IC1.12 24.95,24.9 25.72,24.13 27.62,24.13 28.26,23.5 v28.26,21.27
  Bottom 0.152: v28.26,21.27 23.64,16.66 IC2.22
BA19  (via drill 0.3)
  Top 0.152: IC1.61 5.76,26.4 5.71,26.35 3.49,26.35 v2.54,25.4
  Bottom 0.152: v2.54,25.4 2.54,22.54 6.84,18.24 IC2.1
BA20  (via drill 0.3)
  Top 0.152: IC1.13 25.08,25.4 26.04,24.45 27.94,24.45 28.89,23.5 v28.89,20.64
  Bottom 0.152: v28.89,20.64 28.89,9.53 23.64,4.27 IC2.23
BD0  (via drill 0.3)
  Top 0.152: IC1.79 10.74,14.23 10.16,13.65 v10.16,11.11 10.16,4.45 9.53,3.81 IC3.7
  Bottom 0.152: IC2.9 13.24,14.19 v10.16,11.11
BD1  (via drill 0.3)
  Top 0.152: IC1.81 11.74,13.96 11.43,13.65 v11.43,11.11 11.43,4.45 10.79,3.81 IC3.8
  Bottom 0.152: IC2.10 14.04,13.72 v11.43,11.11
BD2  (via drill 0.3)
  Top 0.152: IC1.85 13.74,14.69 12.7,13.65 v12.7,4.76 12.7,4.45 12.07,3.81 IC3.9
  Bottom 0.152: IC2.36 13.24,4.22 v12.7,4.76
BD3  (via drill 0.3)
  Top 0.152: IC1.87 14.74,14.42 13.97,13.65 v13.97,4.76 13.97,4.45 13.34,3.81 IC3.10
  Bottom 0.152: IC2.35 14.04,4.69 v13.97,4.76
BD4  (via drill 0.3)
  Top 0.152: IC1.89 15.74,14.42 16.51,13.65 v16.51,4.76 16.51,4.45 17.14,3.81 IC3.13
  Bottom 0.152: IC2.32 16.44,4.69 v16.51,4.76
BD5  (via drill 0.3)
  Top 0.152: IC1.91 16.74,14.69 17.78,13.65 v17.78,4.76 17.78,4.45 18.41,3.81 IC3.14
  Bottom 0.152: IC2.31 17.24,4.22 v17.78,4.76
BD6  (via drill 0.3)
  Top 0.152: IC1.93 17.74,14.96 19.05,13.65 v19.05,11.11 19.05,4.45 19.69,3.81 IC3.15
  Bottom 0.152: IC2.13 16.44,13.72 v19.05,11.11
BD7  (via drill 0.3)
  Top 0.152: IC1.95 18.74,15.23 20.32,13.65 v20.32,11.11 20.32,4.45 20.95,3.81 IC3.16
  Bottom 0.152: IC2.14 17.24,14.19 v20.32,11.11
BD8
  Top 0.152: IC1.96 19.24,15.37 20.95,13.65 IC3.29
BD9
  Top 0.152: IC1.94 18.24,15.1 19.69,13.65 IC3.30
BD10
  Top 0.152: IC1.92 17.24,14.83 18.41,13.65 IC3.31
BD11
  Top 0.152: IC1.90 16.24,14.56 17.14,13.65 IC3.32
BD12
  Top 0.152: IC1.86 14.24,14.56 13.34,13.65 IC3.35
BD13
  Top 0.152: IC1.82 12.24,13.83 12.07,13.65 IC3.36
BD14
  Top 0.152: IC1.80 11.24,14.1 10.79,13.65 IC3.37
BD15
  Top 0.152: IC1.78 10.24,14.37 9.53,13.65 IC3.38
D0
  Top 0.152: IC1.60 5.63,26.9 5.4,26.67 2.54,26.67 2.22,26.99 2.22,39.05 HDR1.2
D1
  Top 0.152: IC1.59 5.49,27.4 5.08,26.99 2.86,26.99 2.54,27.3 2.54,36.83 HDR1.3
D2
  Top 0.152: IC1.46 11.24,35.37 HDR1.15A
D3
  Top 0.152: IC1.43 12.74,39.33 HDR1.17A
D4
  Top 0.152: IC1.29 19.74,34.66 20,34.93 20,39.69 HDR1.2A
D5
  Top 0.152: IC1.30 19.24,34.42 19.05,34.61 18.73,34.61 18.1,35.24 18.1,37.15 HDR1.3A
D6
  Top 0.152: IC1.17 25.62,27.4 26.04,26.99 27.3,26.99 27.62,27.3 27.62,34.61 HDR1.15
D7
  Top 0.152: IC1.15 25.35,26.4 25.4,26.35 27.94,26.35 28.26,26.67 28.26,39.05 HDR1.17
GND  (via drill 0.3, 0.46)
  other vias: 11.43,24.13 7.94,32.7 22.54,32.7 7.94,18.1 22.54,18.1 15.88,2.22 14.61,12.7 8.57,25.72
  pour Top: 29.21,44.45 1.27,44.45 arc90 0,43.18 0,1.27 arc90 1.27,0 29.21,0 arc90 30.48,1.27 30.48,43.18 arc90
  pour Bottom (rank 2): 29.21,44.45 1.27,44.45 arc90 0,43.18 0,1.27 arc90 1.27,0 29.21,0 arc90 30.48,1.27 30.48,43.18 arc90
MA0
  Top 0.152: IC1.55 4.89,29.4 HDR1.6
MA1
  Top 0.152: IC1.19 25.23,28.4 26.67,29.84 HDR1.13
MA2
  Top 0.152: IC1.18 23.28,27.94 HDR1.12
MA3
  Top 0.152: IC1.14 25.22,25.9 25.72,25.4 HDR1.11
MA4
  Top 0.152: IC1.63 HDR1.8
MA5
  Top 0.152: IC1.58 3.85,27.9 HDR1.7
MA6
  Top 0.152: IC1.20 24.45,28.9 25.72,30.16 25.72,32.07 HDR1.14
MA7
  Top 0.152: IC1.10 24.68,23.9 25.72,22.86 HDR1.10
TCK  (via drill 0.46)
  Top 0.152: IC1.48 10.24,27.86 TCK.TP
  other vias: 11.43,26.67
TDI  (via drill 0.46)
  Top 0.152: IC1.45 11.74,32.06 TDI.TP
  other vias: 11.43,31.75
TDO  (via drill 0.46)
  Top 0.152: IC1.83 12.74,18.38 12.07,19.05 TDO.TP
  other vias: 11.43,19.05
TMS  (via drill 0.46)
  Top 0.152: IC1.47 10.74,29.9 TMS.TP
  other vias: 11.43,29.21
TP1
  Top 0.152: IC1.50 9.24,34.58 6.35,37.47 1.TP
TP2
  Top 0.152: IC1.49 9.74,34.71 8.89,35.56 2.TP
TP3
  Top 0.152: IC1.42 13.24,41.37 3.TP
TP4  (1 unrouted)
  Top 0.152: 13.74,42.95 4.TP
TP5
  Top 0.152: IC1.33 17.74,34.33 17.46,34.61 17.46,42.23 5.TP
TP6
  Top 0.152: IC1.32 18.24,34.47 17.78,34.93 17.78,41.91 6.TP
TP7
  Top 0.152: IC1.28 20.24,34.53 21.59,35.88 7.TP
TP8
  Top 0.152: IC1.27 20.74,34.39 21.91,35.56 21.91,40.96 8.TP
TP9  (via drill 0.3)
  Top 0.152: IC1.22 24.39,29.9 v24.45,29.84
  Bottom 0.152: v24.45,29.84 25.4,29.84 25.72,30.16 25.72,31.11 26.04,31.43 27.62,31.43 27.94,31.75 27.94,38.42 26.99,39.37 25.4,39.37 9.TP
TP10  (via drill 0.3)
  Top 0.152: IC1.23 25,30.4 v25.08,30.48
  Bottom 0.152: v25.08,30.48 25.4,30.8 25.4,31.43 25.72,31.75 27.3,31.75 27.62,32.07 27.62,36.2 26.99,36.83 25.4,36.83 10.TP
TP11  (via drill 0.3)
  Top 0.152: IC1.24 24.23,30.9 v24.45,31.11
  Bottom 0.152: v24.45,31.11 25.72,32.38 25.72,33.97 11.TP
TP12
  Top 0.152: IC1.25 24.13,32.29 12.TP
TP13
  Top 0.152: IC1.53 6.11,30.4 5.4,31.11 5.4,32.07 4.76,32.7 4.76,33.97 13.TP
TP14
  Top 0.152: IC1.52 6.25,30.9 6.03,31.11 6.03,32.7 14.TP
TP15  (via drill 0.51)
  Top 0.152: IC1.34 17.24,34.2 17.14,34.29 17.14,37.15 15.TP
  other vias: 16.19,38.1
TP16  (via drill 0.51)
  Top 0.152: IC1.35 16.74,35.01 16.TP
  other vias: 16.19,35.56
TP17  (via drill 0.51)
  Top 0.152: IC1.36 16.24,34.56 15.56,35.24 15.56,36.2 17.TP
  other vias: 16.19,36.83
TP18  (via drill 0.51)
  Top 0.152: IC1.37 15.74,34.43 15.24,34.93 15.24,37.15 18.TP
  other vias: 14.29,38.1
TP19  (via drill 0.51)
  Top 0.152: IC1.39 14.74,35.11 19.TP
  other vias: 14.29,35.56
TP20  (via drill 0.51)
  Top 0.152: IC1.40 14.24,34.34 13.65,34.93 13.65,36.2 20.TP
  other vias: 14.29,36.83
VCC
  Bottom 0.305: HDR1.9 13.02,22.86 | C1.1 13.02,22.86 | 13.02,22.86 13.02,20.71 VR1.3